# Altium schematic sheet PLCBOARD.SchDoc
size A4
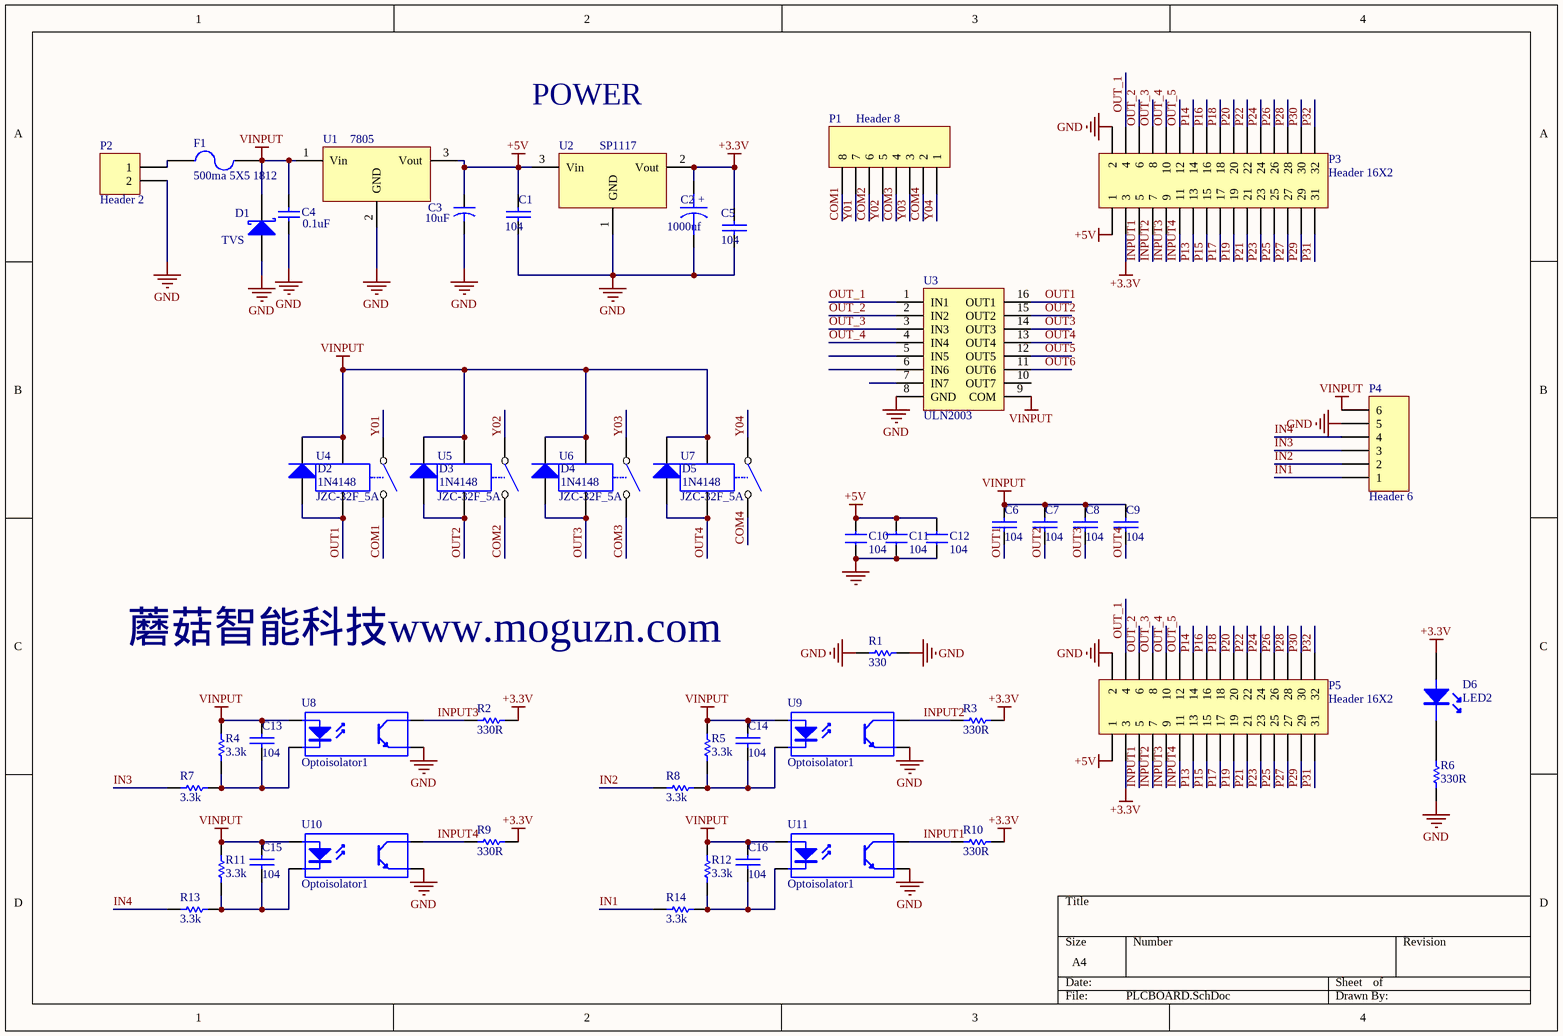
[diagram p0: PLCBOARD.SchDoc]

## Parts
C1  104  [0805C1]
C2  1000uf  [c6.3*5.3]
C3  value 10uF  [RB.2/.4]  (hidden comment: Cap2)
C4  value 0.1uF  [0805C1]  (hidden comment: Cap)
C5  104  [0805C1]
C6  104  [0805C1]
C7  104  [0805C1]
C8  104  [0805C1]
C9  104  [0805C1]
C10  104  [0805C1]
C11  104  [0805C1]
C12  104  [0805C1]
C13  104  [0805C1]
C14  104  [0805C1]
C15  104  [0805C1]
C16  104  [0805C1]
D1  TVS  [do-214]
D2  1N4148  [DIODE_SMD_4148]
D3  1N4148  [DIODE_SMD_4148]
D4  1N4148  [DIODE_SMD_4148]
D5  1N4148  [DIODE_SMD_4148]
D6  LED2  [0805LED]
F1  500ma 5X5 1812  [1812R]
P1  Header 8  [CON8.6_8pin]
P2  Header 2  [5VINPUT]
P3  Header 16X2  [NDK2X16]
P4  Header 6  [CON7.62_6pin]
P5  Header 16X2  [HDR2X16]
R1  value 330  [1812R]  (hidden comment: Res1)
R2  value 330R  [0805R1]  (hidden comment: Res1)
R3  value 330R  [0805R1]  (hidden comment: Res1)
R4  value 3.3k  [0805R1]  (hidden comment: Res1)
R5  value 3.3k  [0805R1]  (hidden comment: Res1)
R6  value 330R  [0805R1]  (hidden comment: Res1)
R7  value 3.3k  [0805R1]  (hidden comment: Res1)
R8  value 3.3k  [0805R1]  (hidden comment: Res1)
R9  value 330R  [0805R1]  (hidden comment: Res1)
R10  value 330R  [0805R1]  (hidden comment: Res1)
R11  value 3.3k  [0805R1]  (hidden comment: Res1)
R12  value 3.3k  [0805R1]  (hidden comment: Res1)
R13  value 3.3k  [0805R1]  (hidden comment: Res1)
R14  value 3.3k  [0805R1]  (hidden comment: Res1)
U1  7805  [7805]
U2  SP1117  [SOT-223]
U3  ULN2003  [SO-16]
U4  JZC-32F_5A  [JZC-32F_5A]
U5  JZC-32F_5A  [JZC-32F_5A]
U6  JZC-32F_5A  [JZC-32F_5A]
U7  JZC-32F_5A  [NT90RHAE12CB_30A]
U8  Optoisolator1  [TLP181-2]
U9  Optoisolator1  [TLP181-2]
U10  Optoisolator1  [TLP181-2]
U11  Optoisolator1  [TLP181-2]

## Nets
+3.3V: C2.1 C5.1 D6.1 P3.3 P5.3 R2.1 R3.1 R9.1 R10.1 U2.2(Vout)
+5V: C1.1 C3.1 C10.2 C11.2 C12.2 P3.1 P5.1 U1.3(Vout) U2.3(Vin)
GND: C1.2 C2.2 C3.2 C4.1 C5.2 C10.1 C11.1 C12.1 D1.1(A) P2.2 P3.2 P4.5 P5.2 R1.1 R1.2 R6.2 U1.2(GND) U2.1(GND) U3.8(GND) U8.3(E) U9.3(E) U10.3(E) U11.3(E)
VINPUT: C4.2 C6.1 C7.1 C8.1 C9.1 C13.1 C14.1 C15.1 C16.1 D1.2(K) D2.2(K) D3.2(K) D4.2(K) D5.2(K) F1.2 P4.6 R4.1 R5.1 R11.1 R12.1 U1.1(Vin) U3.9(COM) U4.3 U5.3 U6.3 U7.3 U8.1(A) U9.1(A) U10.1(A) U11.1(A)
COM1: P1.8 U4.2
COM2: P1.6 U5.2
COM3: P1.4 U6.2
COM4: P1.2 U7.2
IN1: P4.1 R14.1
IN2: P4.2 R8.1
IN3: P4.3 R7.1
IN4: P4.4 R13.1
INPUT1: P3.5 P5.5 R10.2 U11.4(C)
INPUT2: P3.7 P5.7 R3.2 U9.4(C)
INPUT3: P3.9 P5.9 R2.2 U8.4(C)
INPUT4: P3.11 P5.11 R9.2 U10.4(C)
OUT1: C6.2 D2.1(A) U3.16(OUT1) U4.4
OUT2: C7.2 D3.1(A) U3.15(OUT2) U5.4
OUT3: C8.2 D4.1(A) U3.14(OUT3) U6.4
OUT4: C9.2 D5.1(A) U3.13(OUT4) U7.4
OUT5: U3.12(OUT5)
OUT6: U3.11(OUT6)
OUT_1: P3.4 P5.4 U3.1(IN1)
OUT_2: P3.6 P5.6 U3.2(IN2)
OUT_3: P3.8 P5.8 U3.3(IN3)
OUT_4: P3.10 P5.10 U3.4(IN4)
OUT_5: P3.12 P5.12
P13: P3.13 P5.13
P14: P3.14 P5.14
P15: P3.15 P5.15
P16: P3.16 P5.16
P17: P3.17 P5.17
P18: P3.18 P5.18
P19: P3.19 P5.19
P20: P3.20 P5.20
P21: P3.21 P5.21
P22: P3.22 P5.22
P23: P3.23 P5.23
P24: P3.24 P5.24
P25: P3.25 P5.25
P26: P3.26 P5.26
P27: P3.27 P5.27
P28: P3.28 P5.28
P29: P3.29 P5.29
P30: P3.30 P5.30
P31: P3.31 P5.31
P32: P3.32 P5.32
Y01: P1.7 U4.1
Y02: P1.5 U5.1
Y03: P1.3 U6.1
Y04: P1.1 U7.1
NetC13_2: C13.2 R4.2 R7.2 U8.2(K)
NetC14_2: C14.2 R5.2 R8.2 U9.2(K)
NetC15_2: C15.2 R11.2 R13.2 U10.2(K)
NetC16_2: C16.2 R12.2 R14.2 U11.2(K)
NetD6_2: D6.2 R6.1
NetF1_1: F1.1 P2.1

Not connected (* = marked no-connect by the designer): U3 5(IN5) 6(IN6) 7(IN7) 10(OUT7)

## Notes on the sheet
- POWER
- 蘑菇智能科技www.moguzn.com
- (in symbol CAPACITOR POL) +

## Library data of the parts
C1 C5-C16 = CAP: Capacitor
  C10-C12: Value: 104
C2 = CAPACITOR POL: Capacitor
C3 = Cap2: Capacitor; Published: 23-Sep-2002; PackageReference: CAPR5-4X5; Publisher: Altium Limited; PackageDescription: Capacitor; 2 Leads
C4 = Cap: Capacitor; Published: 8-Jun-2000; LatestRevisionDate: 17-Jul-2002; LatestRevisionNote: Re-released for DXP Platform.; PackageReference: RAD-0.3; Publisher: Altium Limited; PackageDescription: Radial Cap, Thru-Hole; 2 Leads; 0.3 in Pin Spacing
D1 = D Schottky: Schottky Diode; Published: 8-Jun-2000; LatestRevisionDate: 17-Jul-2002; LatestRevisionNote: Re-released for DXP Platform.; PackageReference: SMB; Publisher: Altium Limited; PackageDescription: DO-214-AA/SMB; 2 C-Bend Leads; Body 5.3 x 3.6 mm, inc. leads (LxW); Code_JEDEC: DO-214-AA
D2-D5 = Diode: Default Diode; Published: 8-Jun-2000; LatestRevisionDate: 17-Jul-2002; LatestRevisionNote: Re-released for DXP Platform.; PackageVersion: Sep-1996; PackageReference: SMC; Publisher: Altium Limited; PackageDescription: DO-214-AB/SMC; 2 C-Bend Leads; Body 7.9 x 5.9 mm, inc. leads (LxW); Code_JEDEC: DO-214-AB
D6 = LED
F1 = Fuse 2: Fuse; Published: 8-Jun-2000; LatestRevisionDate: 17-Jul-2002; LatestRevisionNote: Re-released for DXP Platform.; PackageReference: PIN-W2/E2.8; Publisher: Altium Limited; PackageDescription: Thru-Hole; 2 Leads
P1 = Header 8: Header, 8-Pin; LatestRevisionDate: 17-Jul-2002; LatestRevisionNote: Re-released for DXP Platform.; Publisher: Altium Limited
P2 = Header 2: Header, 2-Pin; LatestRevisionDate: 17-Jul-2002; LatestRevisionNote: Re-released for DXP Platform.; Publisher: Altium Limited
P3 P5 = Header 16X2: Header, 16-Pin, Dual row; LatestRevisionDate: 17-Jul-2002; LatestRevisionNote: Re-released for DXP Platform.; Publisher: Altium Limited
P4 = Header 6: Header, 6-Pin; LatestRevisionDate: 17-Jul-2002; LatestRevisionNote: Re-released for DXP Platform.; Publisher: Altium Limited
R1-R14 = Res1: Resistor; Published: 8-Jun-2000; LatestRevisionDate: 17-Jul-2002; LatestRevisionNote: Re-released for DXP Platform.; PackageReference: AXIAL-0.3; Publisher: Altium Limited; PackageDescription: Axial Device, Thru-Hole; 2 Leads; 0.3 in Pin Spacing
U1 = 7800
U8-U11 = Optoisolator1: 4-Pin Phototransistor Optocoupler; Published: 24-Mar-1999; LatestRevisionDate: 04-Mar-2005; LatestRevisionNote: Sch pins 3 & 4 Swapped.; DatasheetVersion: Nov-2003; PackageReference: DIP-4; Publisher: Altium Limited